# EAGLE design IncubPower (EAGLE 6.4)
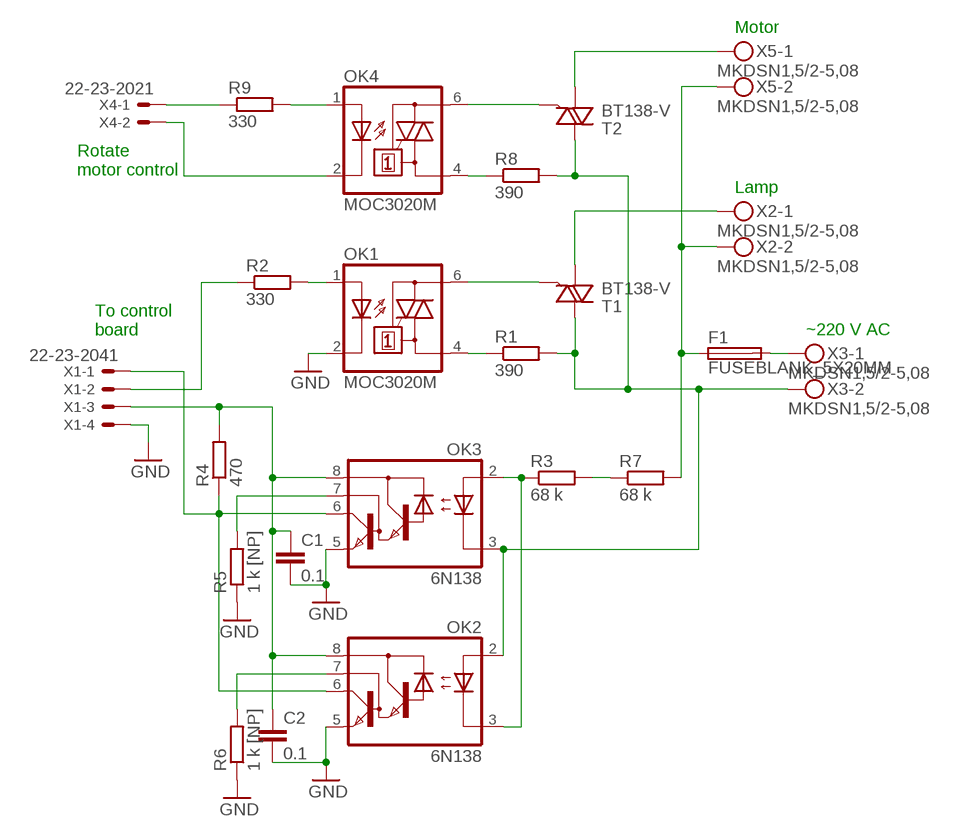
[diagram p0: schematic, sheet 1]

## Parts
C1  0.1  C-EUC0805  [C0805]
C2  0.1  C-EUC0805  [C0805]
F1  FUSEBLANK_5X20MM  [FUSE_HOLDER_5X20MM]
OK1  MOC3020M  [DIL06]
OK2  6N138  [DIL08]
OK3  6N138  [DIL08]
OK4  MOC3020M  [DIL06]
R1  390  R-EU_0204/7  [0204/7]
R2  330  R-EU_R0805  [R0805]
R3  68 k  R-EU_0204/7  [0204/7]
R4  470  R-EU_R0805  [R0805]
R5  1 k [NP]  R-EU_R0805  [R0805]
R6  1 k [NP]  R-EU_R0805  [R0805]
R7  68 k  R-EU_0204/7  [0204/7]
R8  390  R-EU_0204/7  [0204/7]
R9  330  R-EU_R0805  [R0805]
T1  BT138-V  [TO220BV]
T2  BT138-V  [TO220BV]
X1  22-23-2041  [22-23-2041]
X2  MKDSN1,5/2-5,08  [MKDSN1,5/2-5,08]
X3  MKDSN1,5/2-5,08  [MKDSN1,5/2-5,08]
X4  22-23-2021  [22-23-2021]
X5  MKDSN1,5/2-5,08  [MKDSN1,5/2-5,08]

## Nets
GND: C1.2 C2.2 OK1.2(C) OK2.5(GND) OK3.5(GND) R5.1 R6.1 X1.4
N$1: OK1.6(A2) T1.G
N$2: OK1.4(A1) R1.1
N$3: T1.T1(A1) X2.1
N$4: OK1.1(A) R2.2
N$5: R2.1 X1.2
N$6: C1.1 C2.1 OK2.8(VCC) OK3.8(VCC) R4.2 X1.3
N$7: F1.1 R7.2 X2.2 X5.2
N$8: OK2.2(A) OK3.3(C) R1.2 R8.2 T1.T2(A2) T2.T2(A2) X3.2
N$9: F1.2 X3.1
N$10: OK2.3(C) OK3.2(A) R3.1
N$11: OK2.7(VB) R6.2
N$12: OK2.6(VO) OK3.6(VO) R4.1 X1.1
N$13: OK3.7(VB) R5.2
N$14: R3.2 R7.1
N$15: OK4.1(A) R9.2
N$16: R9.1 X4.1
N$17: OK4.2(C) X4.2
N$18: OK4.6(A2) T2.G
N$19: OK4.4(A1) R8.1
N$20: T2.T1(A1) X5.1

## Notes on the sheet
- Motor
- Rotate 
  motor control
- Lamp
- To control
  board
- ~220 V AC

## Library data of the parts
C1 C2 = rcl:C-EU: CAPACITOR, European symbol
F1 = fuse:FUSE: Fuse; OC_FARNELL: unknown; OC_NEWARK: unknown
OK1 OK4 = optocoupler:MOC30*M: RANDOM-PHASE OPTOISOLATORS TRIAC DRIVER OUTPUT Source: http://www.fairchildsemi.com MOC3020-M.pdf; MF: FAIRCHILD SEMICONDUCTOR; MPN: MOC3020-M; OC_FARNELL: 1505425; OC_NEWARK: 72K8895
OK2 OK3 = optocoupler:6N138: MOTOROLA OPTO COUPLER; MF: VISHAY/TELEFUNKEN; MPN: 6N138; OC_FARNELL: 9860150; OC_NEWARK: 35K5294
R1 R2 R4-R6 R8 R9 = rcl:R-EU_: RESISTOR, European symbol
R3 R7 = resistor:R-EU_: RESISTOR, European symbol
T1 T2 = triac:BT138: TRIAC Source: http://www.semiconductors.philips.com BT138_SERIES_2.pdf
X1 = con-molex:22-23-2041: .100" (2.54mm) Center Header - 4 Pin; MF: MOLEX; MPN: 22-23-2041; OC_FARNELL: 1462920; OC_NEWARK: 38C0355
X2 X3 X5 = con-phoenix-508:MKDSN1,5/2-5,08: MKDSN 1,5/ 2-5,08 Printklemme Nennstrom: 13,5 A Nennspannung: 250 V Rastermaß: 5,08 mm Polzahl: 2 Anschlussart: Schraubanschluss Montage: Löten Anschlussrichtung Leiter/Platine: 0 ° Artikelnummer: 1729128 Source: http://eshop.phoenixcontact.com .. 1729128.pdf; MPN: MKDSN 1,5/2-5.08; OC_FARNELL: 1792903; OC_NEWARK: 30M2397
X4 = con-molex:22-23-2021: .100" (2.54mm) Center Header - 2 Pin; MF: MOLEX; MPN: 22-23-2021; OC_FARNELL: 1462926; OC_NEWARK: 25C3832

## Board
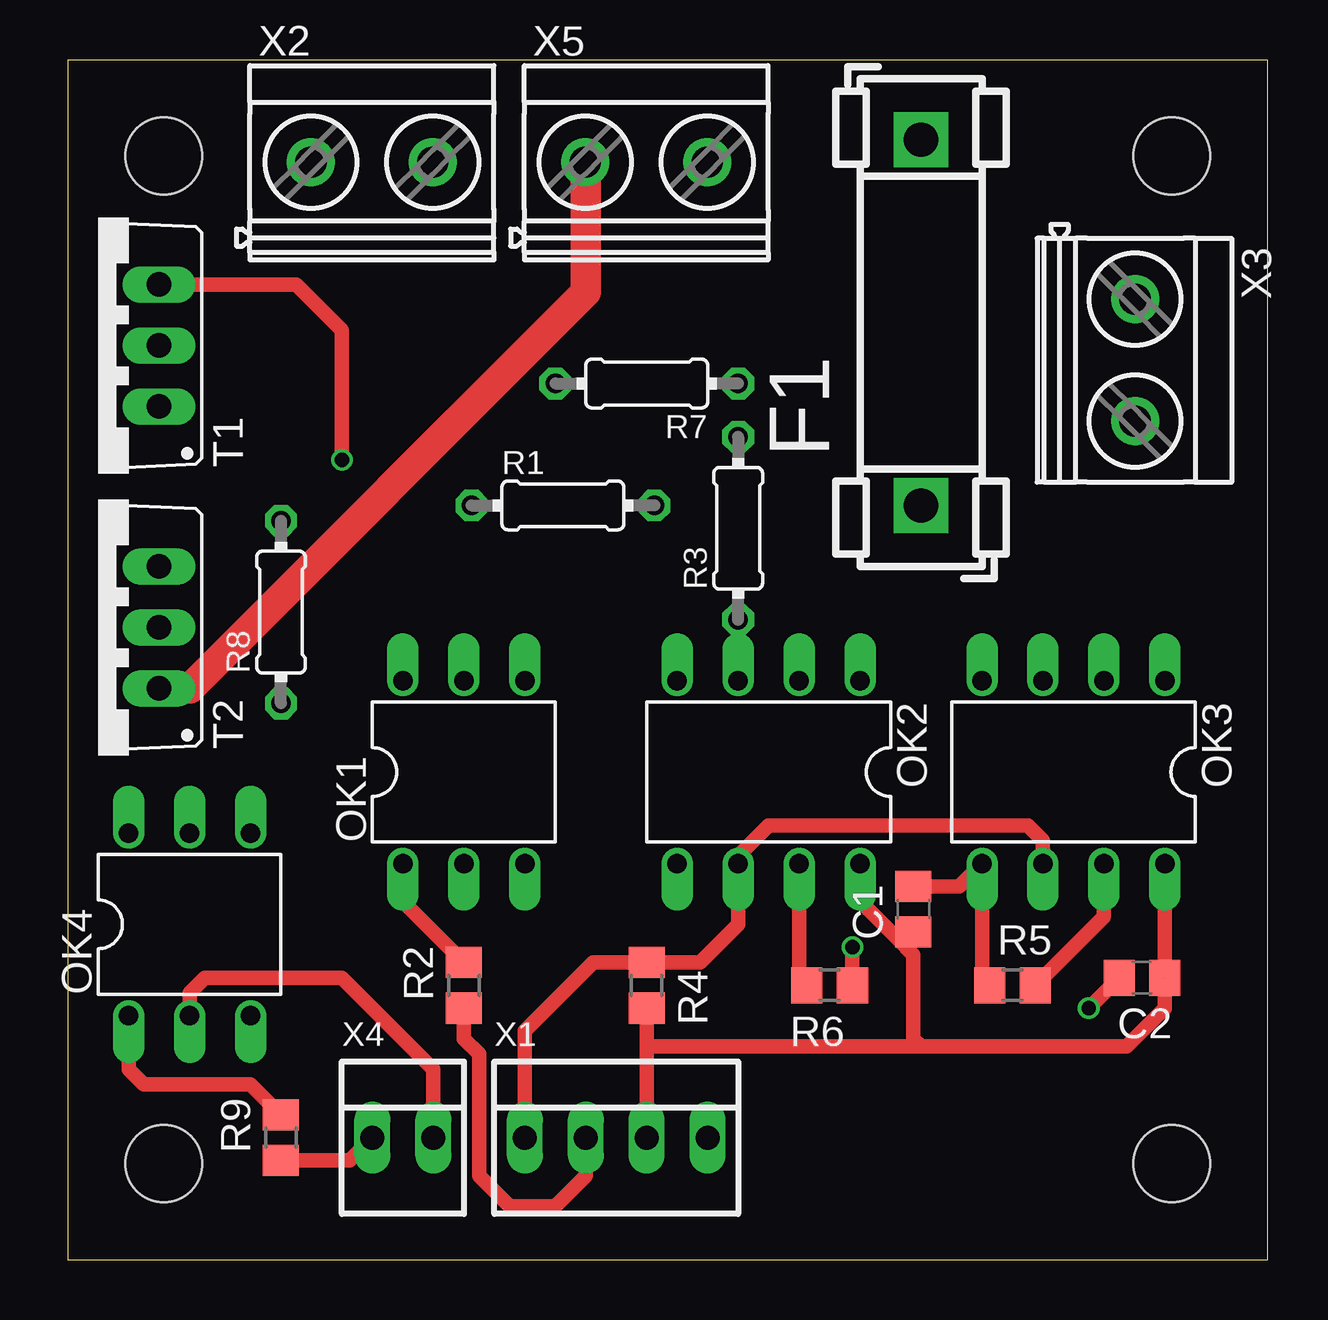
[diagram p1: board, top side]
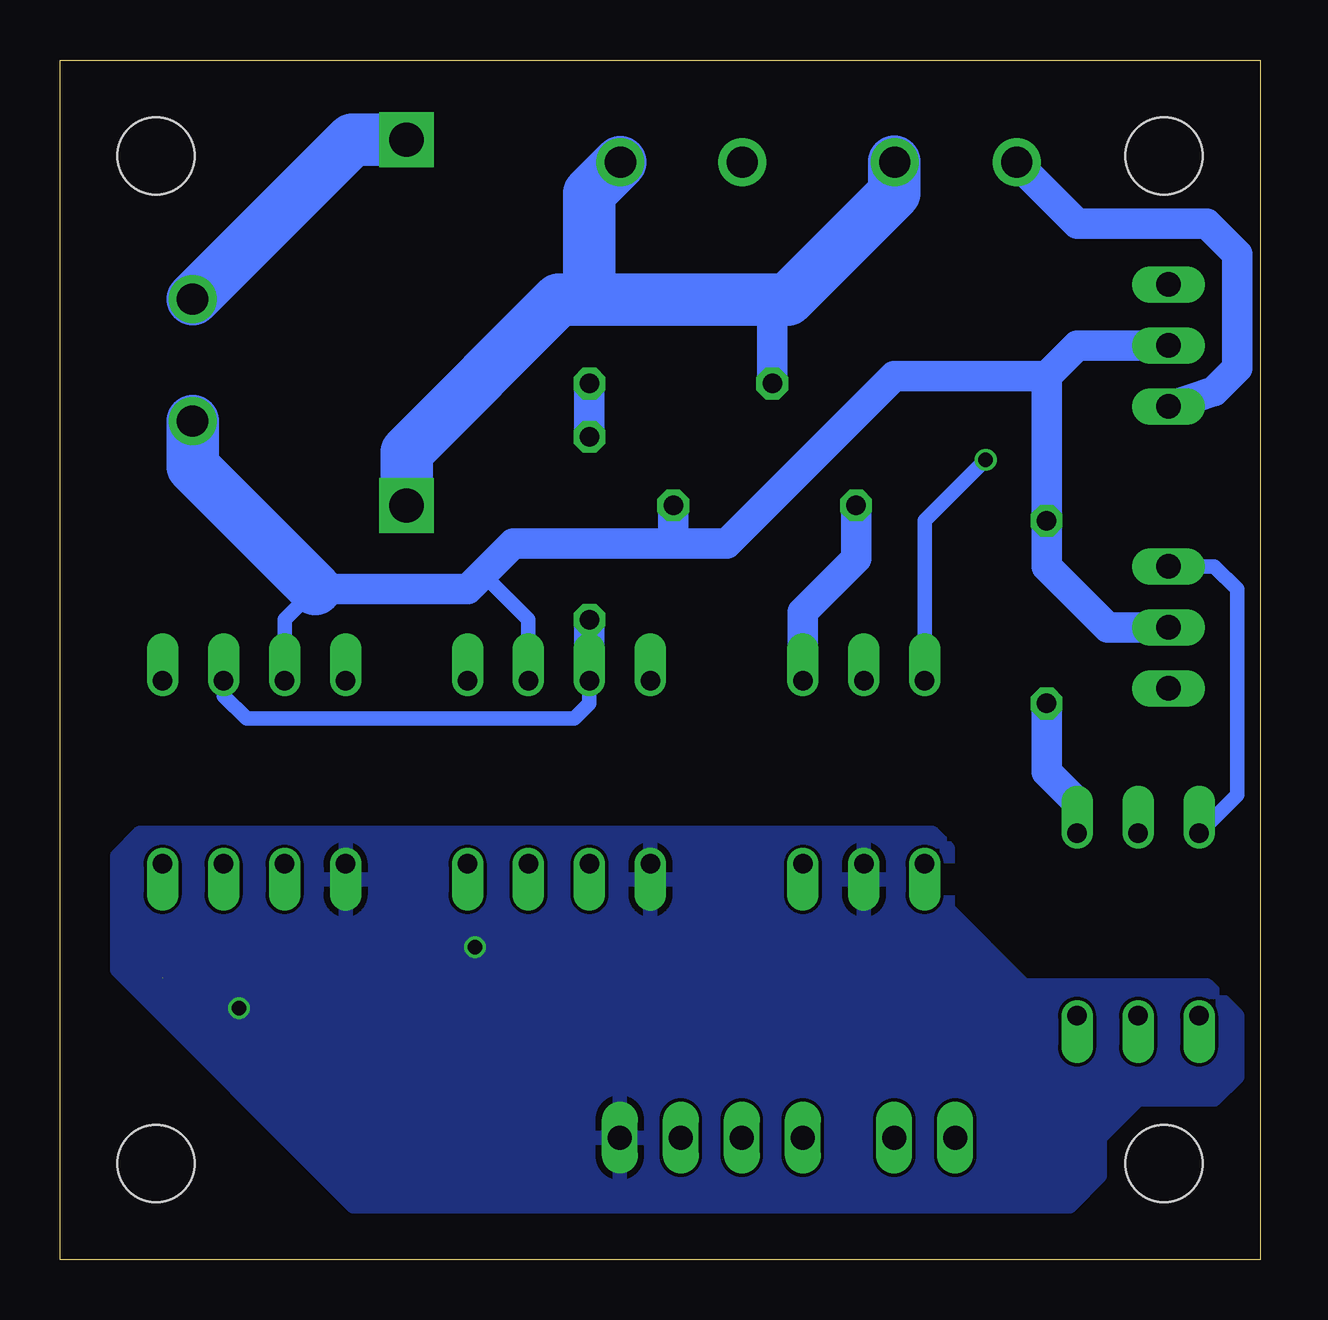
[diagram p2: board, bottom side, seen from below]

Size 50 x 50 mm. Coordinates in mm from the lower left corner, seen from the top.
Outline: 0,0 50,0 50,50 0,50 0,0
Copper layers (1*16): Top 0.035mm / dielectric 1.5mm / Bottom 0.035mm
Design rules "dirt_cheap_dirty_boards.v1": minimum track width 5mil, minimum drill 12mil, track to track 5mil, track to pad 5mil, pad to pad 5mil, via to via 5mil, smd to smd 0mil, copper to edge 10mil, drill to drill 10mil, minimum pad ring 10mil, minimum via ring 6mil, stop-mask expansion 2mil, vias tented up to drill 25mil, thermal gap 10mil
Holes 3.2 mm at 46,4 4,4 46,46 4,46

### Footprints (pad centres in the part's own frame; a part is rotated, then mirrored left to right if it is on the bottom)
C0805 = smd 1.3 x 1.5: 1 -0.95,0; 2 0.95,0
FUSE_HOLDER_5X20MM = drill 1.422 pad 2.286 square: 1 0,0; 2 15.24,0
DIL06 = drill 0.813 offset: 1 -2.54,-3.81; 2 0,-3.81; 3 2.54,-3.81; 4 2.54,3.81; 5 0,3.81; 6 -2.54,3.81
DIL08 = drill 0.813 offset: 1 -3.81,-3.81; 2 -1.27,-3.81; 3 1.27,-3.81; 4 3.81,-3.81; 5 3.81,3.81; 6 1.27,3.81; 7 -1.27,3.81; 8 -3.81,3.81
0204/7 = drill 0.813 octagon: 1 -3.81,0; 2 3.81,0
R0805 = smd 1.3 x 1.5: 1 -0.95,0; 2 0.95,0
TO220BV = drill 1.016 long: G 2.54,-2.54; T1 -2.54,-2.54; T2 0,-2.54
22-23-2041 = drill 1 long: 1 -3.81,0; 2 -1.27,0; 3 1.27,0; 4 3.81,0
MKDSN1,5/2-5,08 = drill 1.3 pad 2: 1 -2.561,0.025; 2 2.519,0.025
22-23-2021 = drill 1 long: 1 -1.27,0; 2 1.27,0

### Placement (x,y rotation side)
C1  35.24,14.61 90 top
C2  44.77,11.75 180 top
F1  35.56,31.43 90 top
OK1  16.51,20.32 0 top
OK2  29.21,20.32 180 top
OK3  41.91,20.32 180 top
OK4  5.08,13.97 0 top
R1  20.64,31.43 0 top
R2  16.51,11.43 90 top
R3  27.94,30.48 90 top
R4  24.13,11.43 270 top
R5  39.37,11.43 0 top
R6  31.75,11.43 180 top
R7  24.13,36.51 180 top
R8  8.89,26.99 90 top
R9  8.89,5.08 90 top
T1  1.27,38.1 90 top
T2  1.27,26.35 90 top
X1  22.86,5.08 0 top
X2  12.7,45.72 0 top
X3  44.45,37.47 270 top
X4  13.97,5.08 0 top
X5  24.13,45.72 0 top

### Tracks (layer width: path | path; a pad name or v marks a point on that pad's centre or on a via)
GND  (via drill 0.6)
  Top 0.61: R5.1 38.1,11.75 OK3.5 37.15,15.55 C1.2 | C2.2 v42.55,10.48 | v32.7,13.02 R6.1
  pour Bottom: 2.22,11.43 9.84,11.43 13.02,14.61 13.02,17.14 13.65,17.78 46.67,17.78 47.62,16.83 47.62,12.06 37.78,2.22 7.94,2.22 6.67,3.49 6.67,5.08 5.08,6.67 1.91,6.67 0.95,7.62 0.95,10.16
N$1  (via drill 0.6)
  Top 0.61: T1.G 9.53,40.64 11.43,38.73 v11.43,33.34
  Bottom 0.61: v11.43,33.34 13.97,30.8 OK1.6
N$2
  Bottom 1.27: OK1.4 19.05,26.99 16.83,29.21 R1.1
N$3
  Bottom 1.27: T1.T1 1.91,36.2 0.95,37.15 0.95,41.91 2.22,43.18 7.62,43.18 10.14,45.7 X2.1
N$4
  Top 0.61: OK1.1 13.97,14.92 R2.2
N$5
  Top 0.61: R2.1 16.51,9.21 17.14,8.57 17.14,3.49 18.41,2.22 20.32,2.22 21.59,3.49 X1.2
N$6  (1 unrouted)
  Top 0.61: OK3.8 C2.1 | 35.56,8.89 44.13,8.89 45.72,10.48 C2.1 | 35.56,8.89 24.13,8.89 | 24.13,8.89 X1.3 | R4.2 24.13,8.89 | OK2.8 33.02,14.92 34.61,13.34 | C1.1 34.92,13.65 34.61,13.34 | 34.61,13.34 35.24,12.7 35.24,9.21 35.56,8.89
N$7
  Bottom 0.305: 20.32,39.69 20.64,40.01
  Bottom 1.27: 26.67,45.77 X5.2 | 15.24,45.77 X2.2 | R7.2 20.32,39.69
  Bottom 2.184: 27.94,40.01 27.94,44.45 X5.2 | F1.1 35.56,33.66 29.21,40.01 27.94,40.01 | 15.24,45.77 15.24,44.45 19.68,40.01 20.64,40.01 27.94,40.01
N$8
  Bottom 0.61: OK2.2 30.48,26.67 32.38,28.57 | OK3.3 40.64,26.67 39.37,27.94
  Bottom 1.27: 39.37,27.94 33.02,27.94 32.38,28.57 31.11,29.84 24.45,29.84 | 24.45,29.84 22.23,29.84 15.24,36.83 8.89,36.83 | 8.89,36.83 R8.2 8.89,28.89 6.35,26.35 T2.T2 | T1.T2 7.62,38.1 8.89,36.83 | R1.2 24.45,29.84
  Bottom 2.184: X3.2 44.48,33.05 39.37,27.94
N$9
  Bottom 2.184: F1.2 37.83,46.67 X3.1
N$10
  Bottom 0.61: OK3.2 43.18,23.5 42.23,22.54 28.57,22.54 27.94,23.18 OK2.3
  Bottom 1.27: R3.1 OK2.3
N$11
  Top 0.61: OK2.7 30.48,11.75 R6.2
N$12
  Top 0.61: X1.1 19.05,8.57 19.05,9.53 21.91,12.38 22.86,12.38 R4.1 22.86,12.38 26.35,12.38 27.94,13.97 OK2.6 27.94,16.83 29.21,18.1 40.01,18.1 40.64,17.46 OK3.6
N$13
  Top 0.61: OK3.7 43.18,14.29 R5.2
N$14
  Bottom 1.27: R7.1 R3.2
N$15
  Top 0.61: OK4.1 2.54,7.94 3.17,7.3 7.62,7.3 R9.2
N$16
  Top 0.61: R9.1 11.75,4.13 X4.1
N$17
  Top 0.61: OK4.2 5.08,11.11 5.71,11.75 11.43,11.75 15.24,7.94 X4.2
N$18
  Bottom 0.61: T2.G 1.91,28.89 0.95,27.94 0.95,19.37 OK4.6
N$19
  Bottom 1.27: R8.1 8.89,20.32 7.62,19.05 OK4.4
N$20
  Top 1.27: X5.1 21.59,45.72 21.59,40.32 5.08,23.81 T2.T1